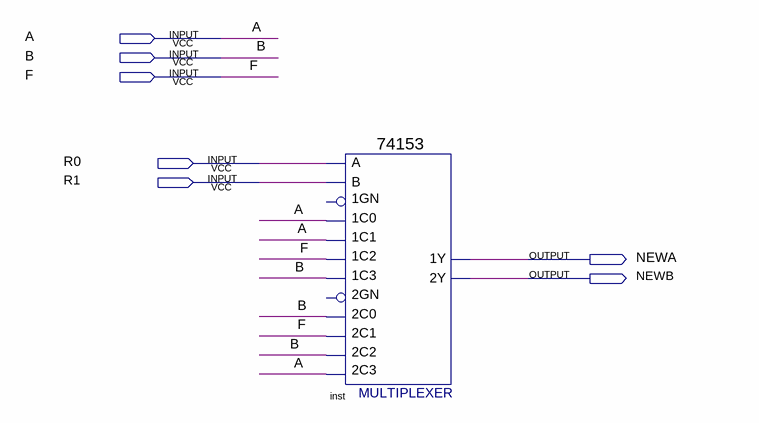
[diagram p0: schematic sheet]
// Quartus schematic routing_unit.bdf as structural Verilog: 1 symbols, 7 pins
module routing_unit (
  input  A,
  input  B,
  input  F,
  input  R0,
  input  R1,
  output NEWA,
  output NEWB
);

  \74153  inst (
    .\1C1 (A), .\1C0 (A), .\2C0 (B), .\2C2 (B), .\1C2 (F), .\1C3 (B), .B(R1), .A(R0), .\2C1 (F), .\2C3 (A),
    .\1Y (NEWA), .\2Y (NEWB));  // open: 1GN, 2GN
endmodule
